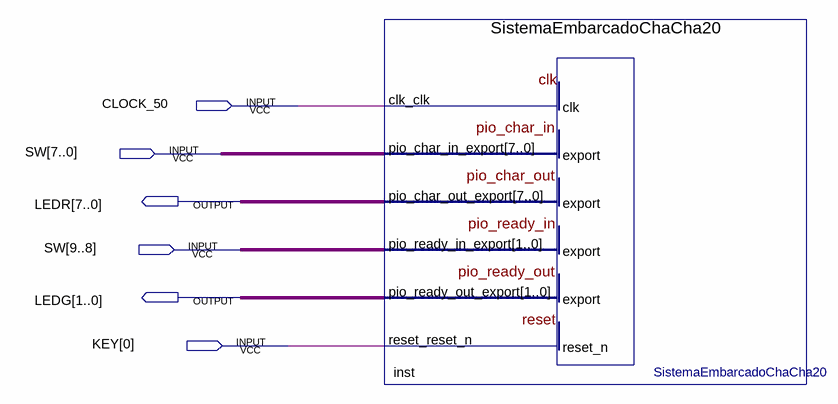
[diagram p0: schematic sheet]
// Quartus schematic ChaCha20.bdf as structural Verilog: 1 symbols, 6 pins
module ChaCha20 (
  input  CLOCK_50,
  input  [9:0] SW,
  input  [0:0] KEY,
  output [7:0] LEDR,
  output [1:0] LEDG
);

  SistemaEmbarcadoChaCha20 inst (
    .clk_clk(CLOCK_50), .pio_char_in_export(SW[7:0]), .pio_ready_in_export(SW[9:8]), .reset_reset_n(KEY[0]),
    .pio_char_out_export(LEDR), .pio_ready_out_export(LEDG));
endmodule
